# EasyEDA Pro project ProPrj_FOC_AT32F413.epro, schematic schematic1_3
Create Date: 2023-11-15; Page Name: P1; Project Name: 基于AT32F413 的FOC驱动器; Schematic Name: Schematic1_3; Update Date: 2023-11-15; Company: 嘉立创EDA; Page Size: A3; Version: V1.0
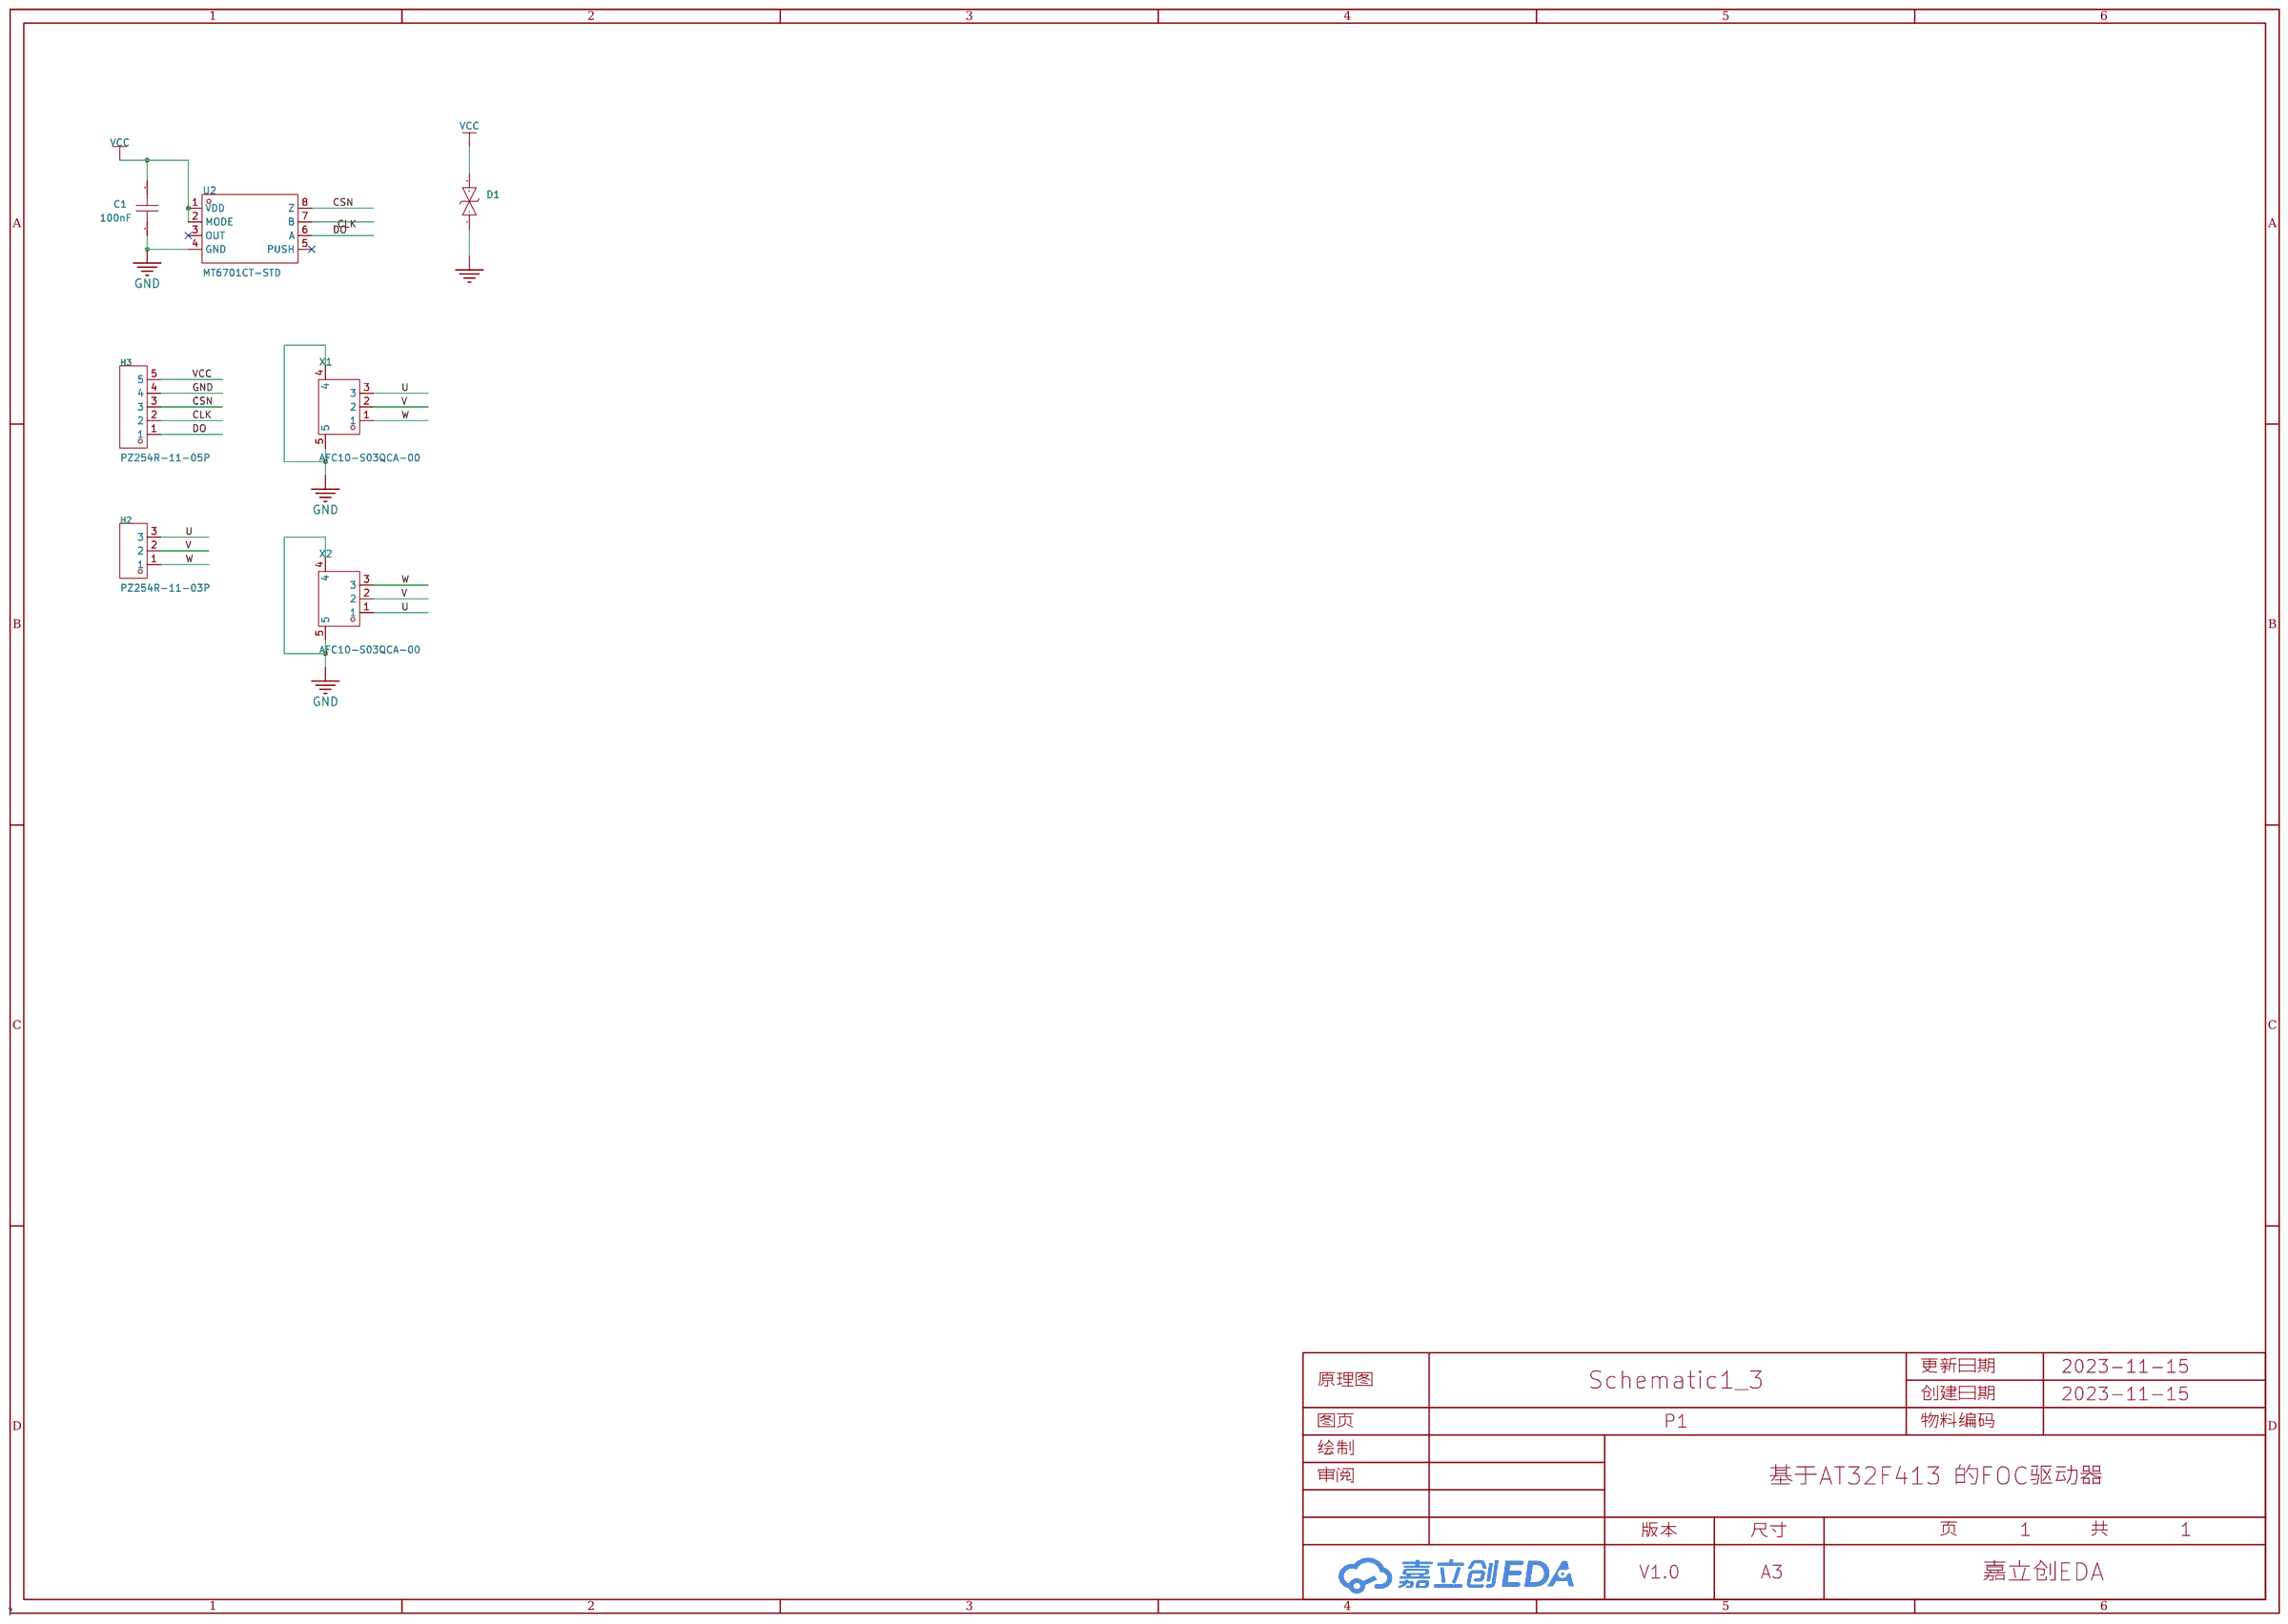
[diagram p6: schematic sheet]

## Parts
C1  100nF  [C0603]
D1  SMF5.0CA  [SOD-123_L2.7-W1.8-LS3.7-BI]
H2  PZ254R-11-03P  [HDR-TH_3P-P2.54-H-M-W10.4]
H3  PZ254R-11-05P  [HDR-TH_5P-P2.54-H-M-W10.4]
U2  MT6701CT-STD  [SOP-8_L4.9-W3.9-P1.27-LS6.0-BL]
X1  AFC10-S03QCA-00  [CONN-SMD_AFC10-S03QCA-00]
X2  AFC10-S03QCA-00  [CONN-SMD_AFC10-S03QCA-00]

## Library data of the parts
C1 = CC0603KRX7R9BB104: 容值:100nF;精度:±10%;额定电压:50V;材质(温度系数):X7R;; LCSC Part Name: 100nF ±10% 50V; Supplier Part: C14663; Manufacturer: YAGEO(国巨); Supplier Footprint: 0603; JLCPCB Part Class: 基础库; Datasheet: https://atta.szlcsc.com/upload/public/pdf/source/20180910/C282072_33301C7F631E79921B82A8DAC6BCC5B3.pdf; Supplier: LCSC; Tolerance: ±10%; Voltage Rated: 50V; Temperature Coefficient: X7R
D1 = SMF5.0CA_C435453: 极性:双向;反向截止电压(Vrwm):5V;击穿电压:6.4V;反向漏电流(Ir):800uA;峰值脉冲电流(Ipp)@10/1000μs:21.7A;最大钳位电压:9.2V;; LCSC Part Name: 双向 Vrwm:5V; Supplier Part: C435453; Manufacturer: AnBon(安邦); Supplier Footprint: SOD-123; JLCPCB Part Class: Extended Part; Datasheet: https://atta.szlcsc.com/upload/public/pdf/source/20191009/C435453_6D1091435A92BAD2FCEBAFDAD46121CC.pdf; Supplier: LCSC; Polarity: 双向; Reverse Stand-Off Voltage (Vrwm): 5V; Breakdown Voltage: 6.4V; Reverse Leakage Current (Ir): 800uA; Peak Pulse Current (Ipp)@10/1000μs: 21.7A; Maximum Clamping Voltage: 9.2V
H2 = PZ254R-11-03P: 排数:单排;总PIN位数:3P;间距:2.54mm;插针结构:1x3P;行距:-;安装类型:弯插;圆针/方针:方针;额定电流:-;额定电压:-;配合针长度:6mm;塑高:2.5mm;触头材质:黄铜;触头镀层:-;工作温度范围:-40℃~+105℃;颜色:黑色;; LCSC Part Name: 2.54mm 1x3P 弯插 方针; Supplier Part: C492411; Manufacturer: XFCN(兴飞); Supplier Footprint: 弯插,P=2.54mm; JLCPCB Part Class: 扩展库; Datasheet: https://atta.szlcsc.com/upload/public/pdf/source/20200309/C492411_5256E8AAA7569F6D33B6ADBFAE4F2888.pdf; Supplier: LCSC; Number of Rows: 单排; Number of Pins: 3P; Pitch: 2.54mm; Pin Structure: 1x3P; Mounting Type: 弯插; Circluar Pins/Square Pins: 方针; Length of Mating Pin: 6mm; Insulation Height: 2.5mm; Contact Material: 黄铜; Operating Temperature Range: -40℃~+105℃; Color: 黑色
H3 = PZ254R-11-05P: 间距:2.54mm;总PIN位数:5;排数:1;插针结构:1x5P;行距:-;安装类型:弯插;圆针/方针:方针;额定电流:-;额定电压:-;配合针长度:6mm;塑高:2.5mm;触头材质:黄铜;触头镀层:-;工作温度范围:-40℃~+105℃;颜色:黑色;; LCSC Part Name: 2.54mm 1x5P 弯插 方针; Supplier Part: C492413; Manufacturer: XFCN(兴飞); Supplier Footprint: 插件,P=2.54mm; JLCPCB Part Class: 扩展库; Supplier: LCSC; Pitch: 2.54mm; Number of Pins: 5; Number of Rows: 1; Pin Structure: 1x5P; Mounting Type: 弯插; Circluar Pins/Square Pins: 方针; Length of Mating Pin: 6mm; Insulation Height: 2.5mm; Contact Material: 黄铜; Operating Temperature Range: -40℃~+105℃; Color: 黑色
U2 = MT6701CT-STD: 磁性编码器 磁性编码开关 磁性角度检测IC 可编程磁性角度位置芯片; LCSC Part Name: 霍尔在线编程角度位置传感器; Supplier Part: C2856764; Manufacturer: MagnTek(麦歌恩); Supplier Footprint: SOP-8; JLCPCB Part Class: 扩展库; Datasheet: https://atta.szlcsc.com/upload/public/pdf/source/20210901/89396AA55DF26524CEF7734A3D9C2FB3.pdf; Supplier: LCSC
X1 X2 = AFC10-S03QCA-00: 参考系列:SH;间距:1mm;插针结构:1x3P;排数:1;每排PIN数:3;行距:-;公母:公型插针;安装方式:卧贴;额定电流:500mA;工作温度范围:-25℃~+85℃;; LCSC Part Name: SH 1.0mm 卧式贴片 3P; Supplier Part: C2764182; Manufacturer: JS(钜硕电子); Supplier Footprint: SMD,P=1mm; JLCPCB Part Class: Extended Part; Datasheet: https://atta.szlcsc.com/upload/public/pdf/source/20210330/C2764181_391AED87194E28CE940989A69A8EDCC4.pdf; Supplier: LCSC; Reference Series: SH; Pitch: 1mm; Pins Structure: 1x3P; Number of Rows: 1; Number of PINs Per Row: 3; Gender: 公型插针; Mounting Style: 卧贴; Current Rating (Max): 500mA; Operating Temperature Range: -25℃~+85℃

## Nets
GND: C1.1 D1.1 H3.4 U2.4(GND) X1.4 X1.5 X2.4 X2.5
VCC: C1.2 D1.2 H3.5 U2.1(VDD) U2.2(MODE)
CLK: H3.2 U2.7(B)
CSN: H3.3 U2.8(Z)
DO: H3.1 U2.6(A)
U: H2.3 X1.3 X2.1
V: H2.2 X1.2 X2.2
W: H2.1 X1.1 X2.3

Not connected (* = marked no-connect by the designer): U2 3(OUT)* 5(PUSH)*
